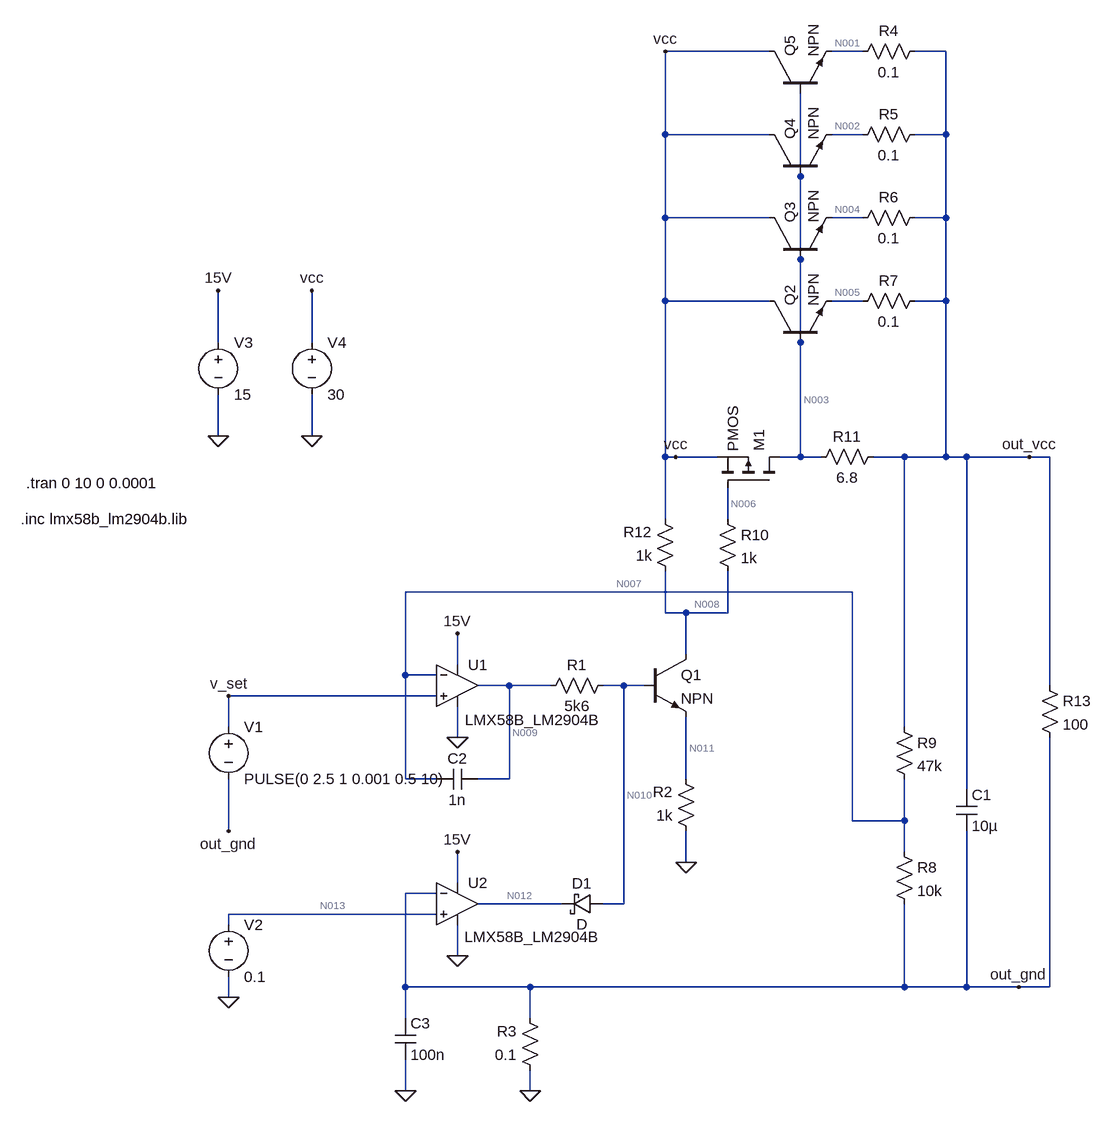
[diagram p0: schematic power_reg.asc]
power_reg.asc, the LTspice schematic file:
Version 4
SHEET 1 1164 680
WIRE 528 -1168 368 -1168
WIRE 672 -1168 624 -1168
WIRE 800 -1168 752 -1168
WIRE 368 -1040 368 -1168
WIRE 528 -1040 368 -1040
WIRE 672 -1040 624 -1040
WIRE 800 -1040 800 -1168
WIRE 800 -1040 752 -1040
WIRE 576 -976 576 -1104
WIRE 368 -912 368 -1040
WIRE 528 -912 368 -912
WIRE 672 -912 624 -912
WIRE 800 -912 800 -1040
WIRE 800 -912 752 -912
WIRE 576 -848 576 -976
WIRE 368 -784 368 -912
WIRE 528 -784 368 -784
WIRE 672 -784 624 -784
WIRE 800 -784 800 -912
WIRE 800 -784 752 -784
WIRE -320 -720 -320 -800
WIRE -176 -720 -176 -800
WIRE 576 -720 576 -848
WIRE -320 -576 -320 -640
WIRE -176 -576 -176 -640
WIRE 368 -544 368 -784
WIRE 384 -544 368 -544
WIRE 448 -544 384 -544
WIRE 576 -544 576 -720
WIRE 576 -544 544 -544
WIRE 608 -544 576 -544
WIRE 736 -544 688 -544
WIRE 800 -544 800 -784
WIRE 800 -544 736 -544
WIRE 832 -544 800 -544
WIRE 928 -544 832 -544
WIRE 960 -544 928 -544
WIRE 368 -448 368 -544
WIRE 464 -448 464 -496
WIRE 656 -336 -32 -336
WIRE 368 -304 368 -368
WIRE 400 -304 368 -304
WIRE 464 -304 464 -368
WIRE 464 -304 400 -304
WIRE 400 -240 400 -304
WIRE 48 -224 48 -272
WIRE -32 -208 -32 -336
WIRE 16 -208 -32 -208
WIRE 128 -192 80 -192
WIRE 192 -192 128 -192
WIRE 304 -192 272 -192
WIRE 336 -192 304 -192
WIRE 960 -192 960 -544
WIRE 16 -176 -304 -176
WIRE -304 -128 -304 -176
WIRE 736 -128 736 -544
WIRE 48 -112 48 -160
WIRE -32 -48 -32 -208
WIRE 16 -48 -32 -48
WIRE 128 -48 128 -192
WIRE 128 -48 80 -48
WIRE 400 -48 400 -144
WIRE 832 -32 832 -544
WIRE 656 16 656 -336
WIRE 736 16 736 -48
WIRE 736 16 656 16
WIRE -304 32 -304 -48
WIRE 736 64 736 16
WIRE 400 80 400 32
WIRE 48 112 48 64
WIRE 16 128 -32 128
WIRE 208 144 80 144
WIRE 304 144 304 -192
WIRE 304 144 272 144
WIRE 16 160 -304 160
WIRE -304 176 -304 160
WIRE 48 224 48 176
WIRE -32 272 -32 128
WIRE 160 272 -32 272
WIRE 736 272 736 144
WIRE 736 272 160 272
WIRE 832 272 832 32
WIRE 832 272 736 272
WIRE 912 272 832 272
WIRE 960 272 960 -112
WIRE 960 272 912 272
WIRE -304 288 -304 256
WIRE -32 320 -32 272
WIRE 160 320 160 272
WIRE -32 432 -32 384
WIRE 160 432 160 400
FLAG 48 64 15V
FLAG 48 -272 15V
FLAG 48 -112 0
FLAG 48 224 0
FLAG 400 80 0
FLAG 160 432 0
FLAG -304 288 0
FLAG -304 32 out_gnd
FLAG 912 272 out_gnd
FLAG -32 432 0
FLAG -320 -576 0
FLAG -176 -576 0
FLAG -320 -800 15V
FLAG -176 -800 vcc
FLAG 368 -1168 vcc
FLAG 928 -544 out_vcc
FLAG -304 -176 v_set
FLAG 384 -544 vcc
SYMBOL OpAmps\\opamp2 48 -256 R0
WINDOW 3 12 117 Left 2
SYMATTR Value LMX58B_LM2904B
SYMATTR InstName U1
SYMBOL OpAmps\\opamp2 48 80 R0
WINDOW 3 11 115 Left 2
SYMATTR Value LMX58B_LM2904B
SYMATTR InstName U2
SYMBOL schottky 272 128 R90
WINDOW 0 0 32 VBottom 2
WINDOW 3 32 32 VTop 2
SYMATTR InstName D1
SYMBOL res 288 -208 R90
WINDOW 0 0 56 VBottom 2
WINDOW 3 32 56 VTop 2
SYMATTR InstName R1
SYMATTR Value 5k6
SYMBOL res 416 48 R180
WINDOW 0 36 76 Left 2
WINDOW 3 36 40 Left 2
SYMATTR InstName R2
SYMATTR Value 1k
SYMBOL res 176 416 R180
WINDOW 0 36 76 Left 2
WINDOW 3 36 40 Left 2
SYMATTR InstName R3
SYMATTR Value 0.1
SYMBOL npn 336 -240 R0
SYMATTR InstName Q1
SYMBOL npn 528 -720 R270
SYMATTR InstName Q2
SYMBOL npn 528 -848 R270
SYMATTR InstName Q3
SYMBOL npn 528 -976 R270
SYMATTR InstName Q4
SYMBOL npn 528 -1104 R270
SYMATTR InstName Q5
SYMBOL res 768 -1184 R90
WINDOW 0 0 56 VBottom 2
WINDOW 3 32 56 VTop 2
SYMATTR InstName R4
SYMATTR Value 0.1
SYMBOL res 768 -1056 R90
WINDOW 0 0 56 VBottom 2
WINDOW 3 32 56 VTop 2
SYMATTR InstName R5
SYMATTR Value 0.1
SYMBOL res 768 -928 R90
WINDOW 0 0 56 VBottom 2
WINDOW 3 32 56 VTop 2
SYMATTR InstName R6
SYMATTR Value 0.1
SYMBOL res 768 -800 R90
WINDOW 0 0 56 VBottom 2
WINDOW 3 32 56 VTop 2
SYMATTR InstName R7
SYMATTR Value 0.1
SYMBOL res 720 48 R0
SYMATTR InstName R8
SYMATTR Value 10k
SYMBOL res 720 -144 R0
SYMATTR InstName R9
SYMATTR Value 47k
SYMBOL cap 816 -32 R0
SYMATTR InstName C1
SYMATTR Value 10µ
SYMATTR SpiceLine Rser=1
SYMBOL cap 80 -64 R90
WINDOW 0 0 32 VBottom 2
WINDOW 3 32 32 VTop 2
SYMATTR InstName C2
SYMATTR Value 1n
SYMATTR SpiceLine Rser=1
SYMBOL pmos 544 -496 M270
SYMATTR InstName M1
SYMBOL res 448 -464 R0
SYMATTR InstName R10
SYMATTR Value 1k
SYMBOL res 704 -560 R90
WINDOW 0 0 56 VBottom 2
WINDOW 3 32 56 VTop 2
SYMATTR InstName R11
SYMATTR Value 6.8
SYMBOL res 384 -352 R180
WINDOW 0 36 76 Left 2
WINDOW 3 36 40 Left 2
SYMATTR InstName R12
SYMATTR Value 1k
SYMBOL voltage -304 -144 R0
WINDOW 123 0 0 Left 0
WINDOW 39 0 0 Left 0
SYMATTR InstName V1
SYMATTR Value PULSE(0 2.5 1 0.001 0.5 10)
SYMBOL voltage -304 160 R0
WINDOW 123 0 0 Left 0
WINDOW 39 0 0 Left 0
SYMATTR InstName V2
SYMATTR Value 0.1
SYMBOL cap -48 320 R0
SYMATTR InstName C3
SYMATTR Value 100n
SYMATTR SpiceLine Rser=1
SYMBOL voltage -320 -736 R0
WINDOW 123 0 0 Left 0
WINDOW 39 0 0 Left 0
SYMATTR InstName V3
SYMATTR Value 15
SYMBOL voltage -176 -736 R0
WINDOW 123 0 0 Left 0
WINDOW 39 0 0 Left 0
SYMATTR InstName V4
SYMATTR Value 30
SYMBOL res 944 -208 R0
SYMATTR InstName R13
SYMATTR Value 100
TEXT -624 -448 Left 2 !.inc lmx58b_lm2904b.lib
TEXT -616 -504 Left 2 !.tran 0 10 0 0.0001

The netlist it stands for:
* power_reg.asc
XU1 v_set N007 15V 0 N009 LMX58B_LM2904B  ; pins In+ In- V+ V- OUT
XU2 N013 out_gnd 15V 0 N012 LMX58B_LM2904B  ; pins In+ In- V+ V- OUT
D1 N010 N012 D
R1 N010 N009 5k6
R2 0 N011 1k
R3 0 out_gnd 0.1
Q1 N008 N010 N011 0 NPN
Q2 vcc N003 N005 0 NPN
Q3 vcc N003 N004 0 NPN
Q4 vcc N003 N002 0 NPN
Q5 vcc N003 N001 0 NPN
R4 out_vcc N001 0.1
R5 out_vcc N002 0.1
R6 out_vcc N004 0.1
R7 out_vcc N005 0.1
R8 N007 out_gnd 10k
R9 out_vcc N007 47k
C1 out_vcc out_gnd 10µ Rser=1
C2 N009 N007 1n Rser=1
M1 N003 N006 vcc vcc PMOS
R10 N006 N008 1k
R11 out_vcc N003 6.8
R12 N008 vcc 1k
V1 v_set out_gnd PULSE(0 2.5 1 0.001 0.5 10)
V2 N013 0 0.1
C3 out_gnd 0 100n Rser=1
V3 15V 0 15
V4 vcc 0 30
R13 out_vcc out_gnd 100
.model D D
.lib standard.dio
.model NPN NPN
.model PNP PNP
.lib standard.bjt
.model NMOS NMOS
.model PMOS PMOS
.lib standard.mos
.inc lmx58b_lm2904b.lib
.tran 0 10 0 0.0001
.backanno
.end

* Results of the author's LTspice run, read from the files saved beside the schematic
* Operating Point, zero values left out:
*   V(n009) = 1.303 V
*   V(15v) = 15 V
*   V(n007) = 124.7 µV
*   V(v_set) = 265.6 nV
*   V(n012) = 13.83 V
*   V(out_gnd) = 265.6 nV
*   V(n013) = 100 mV
*   V(n010) = 1.275 V
*   V(n011) = 517.6 mV
*   V(n008) = 29.49 V
*   V(vcc) = 30 V
*   V(n003) = 280.5 µV
*   V(n005) = 262.6 µV
*   V(n004) = 262.6 µV
*   V(n002) = 262.6 µV
*   V(n001) = 262.6 µV
*   V(out_vcc) = 262.6 µV
*   V(n006) = 29.49 V
*   Ic(Q5) = 30 pA
*   Ib(Q5) = -30 pA
*   Ic(Q4) = 30 pA
*   Ib(Q4) = -30 pA
*   Ic(Q3) = 30 pA
*   Ib(Q3) = -30 pA
*   Ic(Q2) = 30 pA
*   Ib(Q2) = -30 pA
*   Ic(Q1) = 512.5 µA
*   Ib(Q1) = 5.125 µA
*   Ie(Q1) = -517.6 µA
*   Id(M1) = -2.626 µA
*   Ib(M1) = 30.01 pA
*   Is(M1) = 2.626 µA
*   I(C1) = -6.933 pA
*   I(D1) = -12.57 pA
*   I(R13) = 2.624 µA
*   I(R12) = -512.5 µA
*   I(R11) = -2.627 µA
*   I(R9) = 2.935 nA
*   I(R8) = 12.44 nA
*   I(R3) = -2.656 µA
*   I(R2) = -517.6 µA
*   I(R1) = -5.125 µA
*   I(V4) = -515.1 µA
*   I(V3) = -605.1 µA
*   I(V2) = 10.01 nA
*   I(V1) = 10.01 nA
*   Ix(u1:IN+) = -10.01 nA
*   Ix(u1:IN-) = -9.508 nA
*   Ix(u1:VCC) = 305.1 µA
*   Ix(u1:VEE) = -300 µA
*   Ix(u1:OUT) = -5.125 µA
*   Ix(u2:IN+) = -10.01 nA
*   Ix(u2:IN-) = -9.508 nA
*   Ix(u2:VCC) = 300 µA
*   Ix(u2:VEE) = -300 µA
*   Ix(u2:OUT) = -12.57 pA
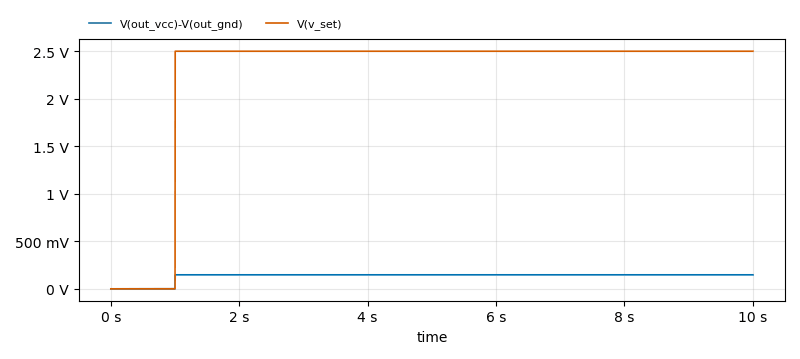
[diagram p1: Transient Analysis of power_reg.asc, plotted from the saved traces]
* Transient Analysis, 1 run:
*   V(out_vcc)-V(out_gnd): min 262.3 µV, max 147.6 mV, average 132.8 mV, rms 140 mV, last 147.6 mV
*   V(v_set): min 265.5 nV, max 2.5 V, average 2.25 V, rms 2.372 V, last 2.5 V